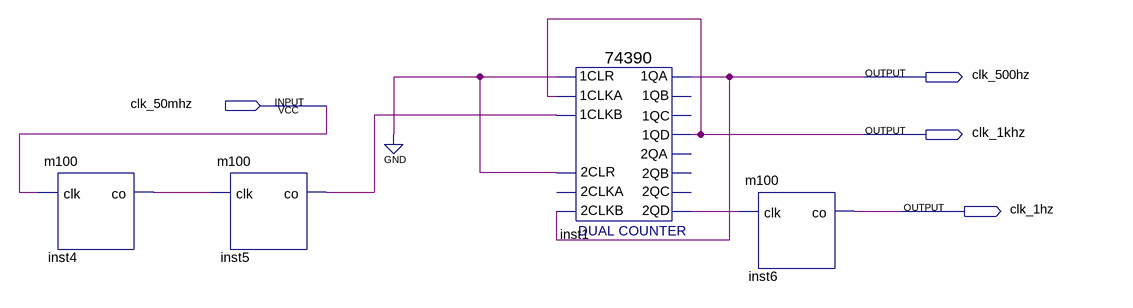
[diagram p0: schematic sheet]
// Quartus schematic fre_div.bdf as structural Verilog: 4 symbols, 4 pins
module fre_div (
  input  clk_50mhz,
  output clk_500hz,
  output clk_1khz,
  output clk_1hz
);

  wire inst1_2qd, inst4_co, inst5_co;

  m100 inst4 (.clk(clk_50mhz), .co(inst4_co));
  m100 inst5 (.clk(inst4_co), .co(inst5_co));
  \74390  inst1 (
    .\2CLR (1'b0), .\2CLKB (clk_500hz), .\1CLR (1'b0), .\1CLKA (clk_1khz), .\1CLKB (inst5_co),
    .\1QA (clk_500hz), .\1QD (clk_1khz), .\2QD (inst1_2qd));  // open: 2CLKA, 1QB, 1QC, 2QA, 2QB, 2QC
  m100 inst6 (.clk(inst1_2qd), .co(clk_1hz));
endmodule
